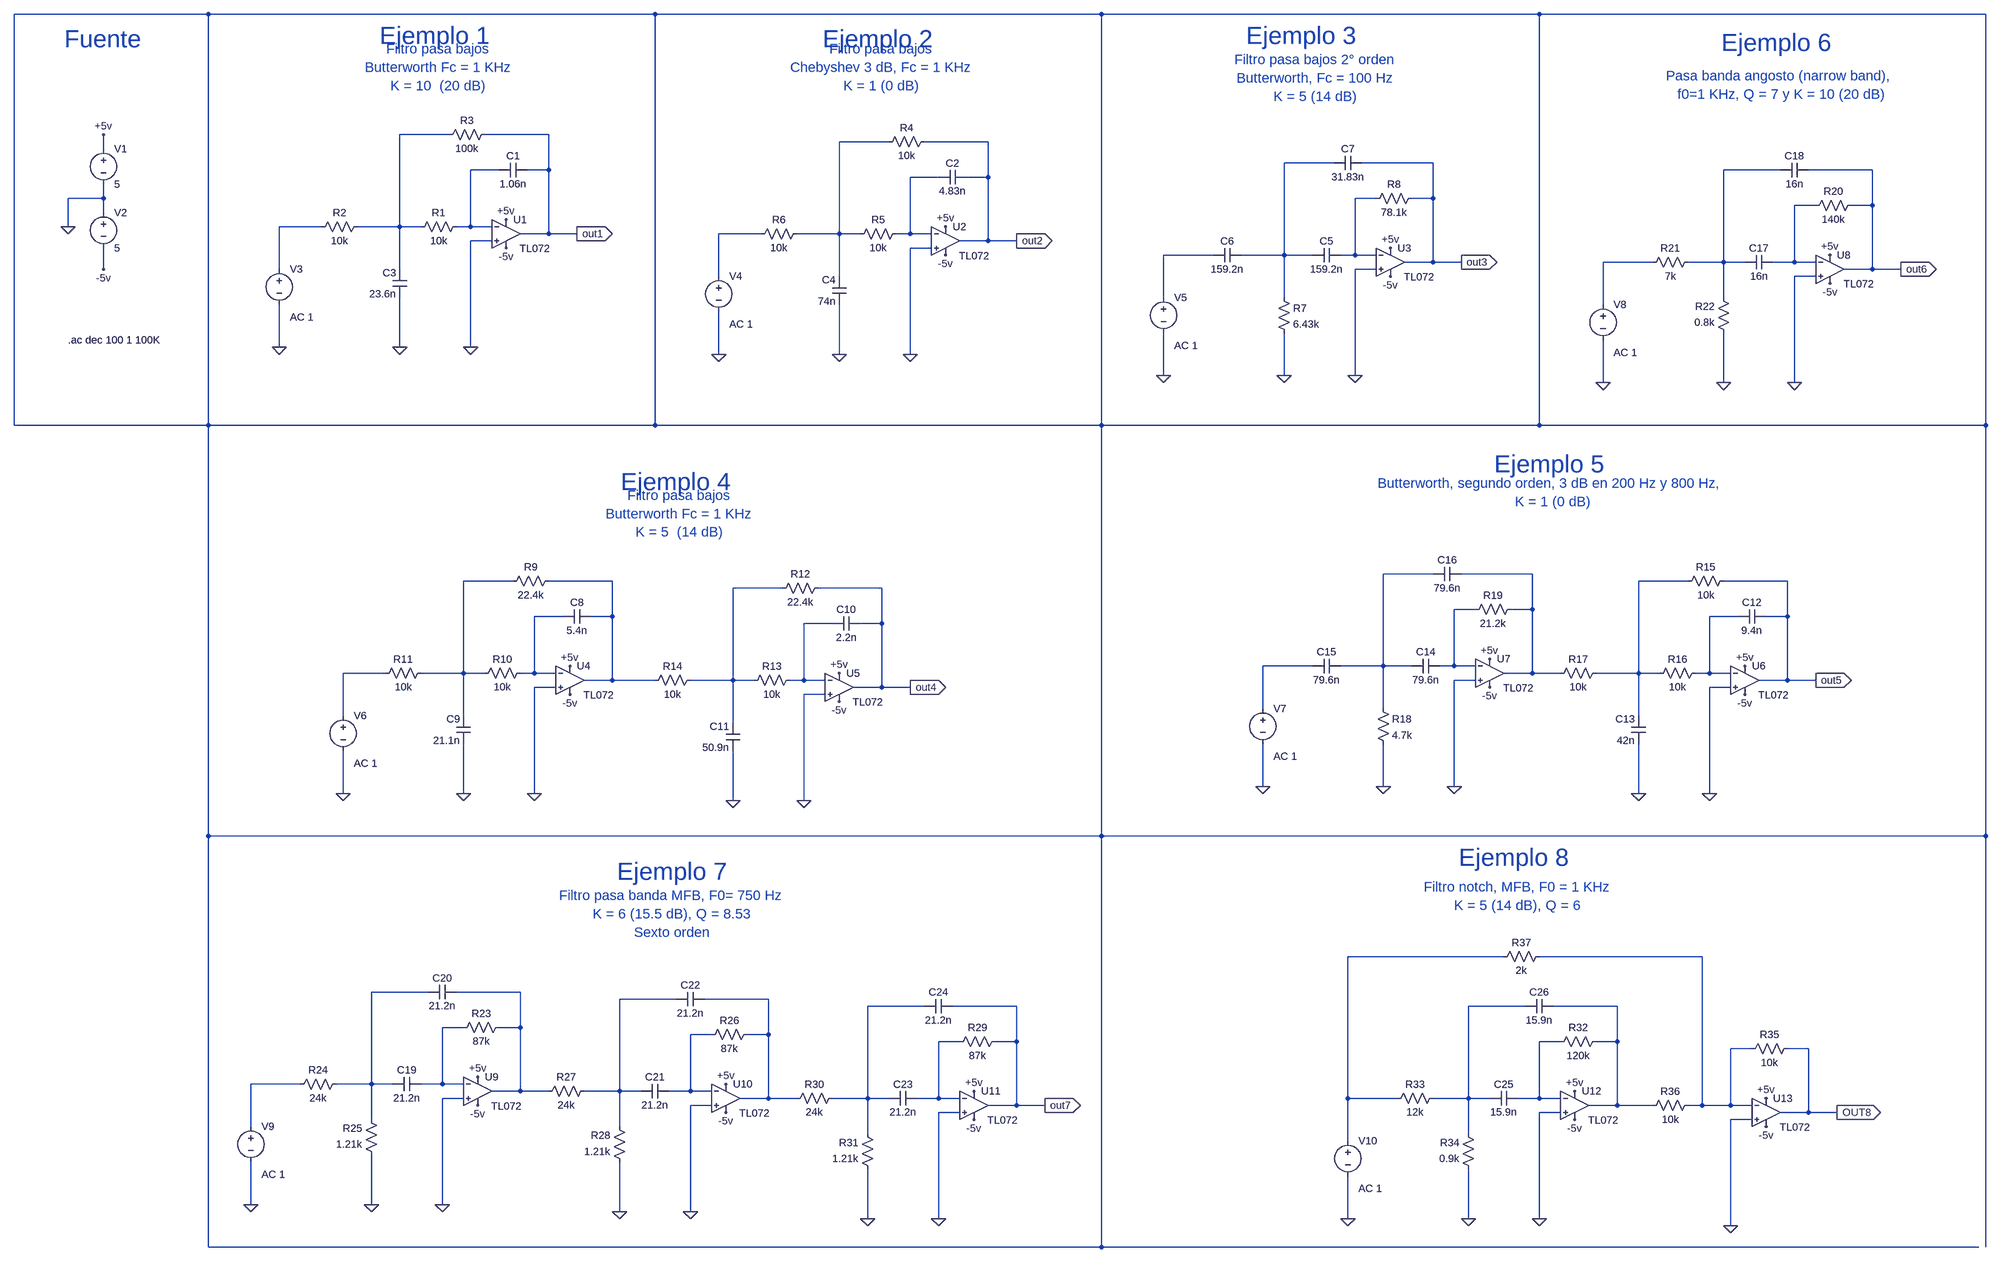
[diagram p0: schematic Filtros2.asc]
Filtros2.asc, the LTspice schematic file:
Version 4
SHEET 1 7476 4980
WIRE -352 -464 -832 -464
WIRE 656 -464 -352 -464
WIRE 1664 -464 656 -464
WIRE 2672 -464 1664 -464
WIRE 3680 -464 2672 -464
WIRE 192 -192 80 -192
WIRE 416 -192 272 -192
WIRE 1184 -176 1072 -176
WIRE 1408 -176 1264 -176
WIRE -592 -160 -592 -192
WIRE 2208 -128 2096 -128
WIRE 2432 -128 2272 -128
WIRE 304 -112 240 -112
WIRE 416 -112 416 -192
WIRE 416 -112 368 -112
WIRE 3216 -112 3088 -112
WIRE 3424 -112 3280 -112
WIRE 1296 -96 1232 -96
WIRE 1408 -96 1408 -176
WIRE 1408 -96 1360 -96
WIRE -592 -48 -592 -80
WIRE -592 -48 -672 -48
WIRE 2304 -48 2256 -48
WIRE 2432 -48 2432 -128
WIRE 2432 -48 2384 -48
WIRE 3296 -32 3248 -32
WIRE 3424 -32 3424 -112
WIRE 3424 -32 3376 -32
WIRE -592 -16 -592 -48
WIRE -672 16 -672 -48
WIRE -96 16 -192 16
WIRE 80 16 80 -192
WIRE 80 16 -16 16
WIRE 128 16 80 16
WIRE 240 16 240 -112
WIRE 240 16 208 16
WIRE 288 16 240 16
WIRE 416 32 416 -112
WIRE 416 32 352 32
WIRE 480 32 416 32
WIRE 896 32 800 32
WIRE 1072 32 1072 -176
WIRE 1072 32 976 32
WIRE 1120 32 1072 32
WIRE 1232 32 1232 -96
WIRE 1232 32 1200 32
WIRE 1280 32 1232 32
WIRE 288 48 240 48
WIRE 1408 48 1408 -96
WIRE 1408 48 1344 48
WIRE 1472 48 1408 48
WIRE 1280 64 1232 64
WIRE 1936 80 1824 80
WIRE 2096 80 2096 -128
WIRE 2096 80 2000 80
WIRE 2160 80 2096 80
WIRE 2256 80 2256 -48
WIRE 2256 80 2224 80
WIRE 2304 80 2256 80
WIRE 2432 96 2432 -48
WIRE 2432 96 2368 96
WIRE 2496 96 2432 96
WIRE 2928 96 2816 96
WIRE 3088 96 3088 -112
WIRE 3088 96 3008 96
WIRE 3136 96 3088 96
WIRE 3248 96 3248 -32
WIRE 3248 96 3200 96
WIRE 3296 96 3248 96
WIRE -592 112 -592 64
WIRE -192 112 -192 16
WIRE 80 112 80 16
WIRE 2304 112 2256 112
WIRE 3424 112 3424 -32
WIRE 3424 112 3360 112
WIRE 3488 112 3424 112
WIRE 800 128 800 32
WIRE 1072 128 1072 32
WIRE 3296 128 3248 128
WIRE 1824 176 1824 80
WIRE 2096 176 2096 80
WIRE 3088 176 3088 96
WIRE 2816 192 2816 96
WIRE -192 288 -192 192
WIRE 80 288 80 176
WIRE 240 288 240 48
WIRE 800 304 800 208
WIRE 1072 304 1072 192
WIRE 1232 304 1232 64
WIRE 1824 352 1824 256
WIRE 2096 352 2096 256
WIRE 2256 352 2256 112
WIRE 2816 368 2816 272
WIRE 3088 368 3088 256
WIRE 3248 368 3248 128
WIRE -832 464 -832 -464
WIRE -352 464 -352 -464
WIRE -352 464 -832 464
WIRE 656 464 656 -464
WIRE 656 464 -352 464
WIRE 1664 464 1664 -464
WIRE 1664 464 656 464
WIRE 2672 464 2672 -464
WIRE 2672 464 1664 464
WIRE 3680 464 3680 -464
WIRE 3680 464 2672 464
WIRE 2432 800 2320 800
WIRE 2656 800 2496 800
WIRE 336 816 224 816
WIRE 560 816 416 816
WIRE 3008 816 2896 816
WIRE 3232 816 3088 816
WIRE 944 832 832 832
WIRE 1168 832 1024 832
WIRE 2528 880 2480 880
WIRE 2656 880 2656 800
WIRE 2656 880 2608 880
WIRE 448 896 384 896
WIRE 560 896 560 816
WIRE 560 896 512 896
WIRE 3120 896 3056 896
WIRE 3232 896 3232 816
WIRE 3232 896 3184 896
WIRE 1056 912 992 912
WIRE 1168 912 1168 832
WIRE 1168 912 1120 912
WIRE 2160 1008 2048 1008
WIRE 2320 1008 2320 800
WIRE 2320 1008 2224 1008
WIRE 2384 1008 2320 1008
WIRE 2480 1008 2480 880
WIRE 2480 1008 2448 1008
WIRE 2528 1008 2480 1008
WIRE 48 1024 -48 1024
WIRE 224 1024 224 816
WIRE 224 1024 128 1024
WIRE 272 1024 224 1024
WIRE 384 1024 384 896
WIRE 384 1024 352 1024
WIRE 432 1024 384 1024
WIRE 2656 1024 2656 880
WIRE 2656 1024 2592 1024
WIRE 2720 1024 2656 1024
WIRE 2896 1024 2896 816
WIRE 2896 1024 2800 1024
WIRE 2944 1024 2896 1024
WIRE 3056 1024 3056 896
WIRE 3056 1024 3024 1024
WIRE 3104 1024 3056 1024
WIRE 560 1040 560 896
WIRE 560 1040 496 1040
WIRE 656 1040 560 1040
WIRE 832 1040 832 832
WIRE 832 1040 736 1040
WIRE 880 1040 832 1040
WIRE 992 1040 992 912
WIRE 992 1040 960 1040
WIRE 1040 1040 992 1040
WIRE 2528 1040 2480 1040
WIRE 3232 1040 3232 896
WIRE 3232 1040 3168 1040
WIRE 3296 1040 3232 1040
WIRE 432 1056 384 1056
WIRE 1168 1056 1168 912
WIRE 1168 1056 1104 1056
WIRE 1232 1056 1168 1056
WIRE 3104 1056 3056 1056
WIRE 1040 1072 992 1072
WIRE 2048 1104 2048 1008
WIRE 2320 1104 2320 1008
WIRE -48 1120 -48 1024
WIRE 224 1120 224 1024
WIRE 2896 1120 2896 1024
WIRE 832 1136 832 1040
WIRE 2048 1280 2048 1184
WIRE 2320 1280 2320 1184
WIRE 2480 1280 2480 1040
WIRE -48 1296 -48 1200
WIRE 224 1296 224 1184
WIRE 384 1296 384 1056
WIRE 2896 1296 2896 1184
WIRE 3056 1296 3056 1056
WIRE 832 1312 832 1200
WIRE 992 1312 992 1072
WIRE -352 1392 -352 464
WIRE 1664 1392 1664 464
WIRE 1664 1392 -352 1392
WIRE 3680 1392 3680 464
WIRE 3680 1392 1664 1392
WIRE 2592 1664 2240 1664
WIRE 3040 1664 2672 1664
WIRE 144 1744 16 1744
WIRE 352 1744 208 1744
WIRE 704 1760 576 1760
WIRE 912 1760 768 1760
WIRE 1264 1776 1136 1776
WIRE 1472 1776 1328 1776
WIRE 2640 1776 2512 1776
WIRE 2848 1776 2704 1776
WIRE 224 1824 176 1824
WIRE 352 1824 352 1744
WIRE 352 1824 304 1824
WIRE 784 1840 736 1840
WIRE 912 1840 912 1760
WIRE 912 1840 864 1840
WIRE 1344 1856 1296 1856
WIRE 1472 1856 1472 1776
WIRE 1472 1856 1424 1856
WIRE 2720 1856 2672 1856
WIRE 2848 1856 2848 1776
WIRE 2848 1856 2800 1856
WIRE 3152 1872 3104 1872
WIRE 3280 1872 3232 1872
WIRE -144 1952 -256 1952
WIRE 16 1952 16 1744
WIRE 16 1952 -64 1952
WIRE 64 1952 16 1952
WIRE 176 1952 176 1824
WIRE 176 1952 128 1952
WIRE 224 1952 176 1952
WIRE 352 1968 352 1824
WIRE 352 1968 288 1968
WIRE 416 1968 352 1968
WIRE 576 1968 576 1760
WIRE 576 1968 496 1968
WIRE 624 1968 576 1968
WIRE 736 1968 736 1840
WIRE 736 1968 688 1968
WIRE 784 1968 736 1968
WIRE 224 1984 176 1984
WIRE 912 1984 912 1840
WIRE 912 1984 848 1984
WIRE 976 1984 912 1984
WIRE 1136 1984 1136 1776
WIRE 1136 1984 1056 1984
WIRE 1184 1984 1136 1984
WIRE 1296 1984 1296 1856
WIRE 1296 1984 1248 1984
WIRE 1344 1984 1296 1984
WIRE 2240 1984 2240 1664
WIRE 2352 1984 2240 1984
WIRE 2512 1984 2512 1776
WIRE 2512 1984 2432 1984
WIRE 2560 1984 2512 1984
WIRE 2672 1984 2672 1856
WIRE 2672 1984 2624 1984
WIRE 2720 1984 2672 1984
WIRE 784 2000 736 2000
WIRE 1472 2000 1472 1856
WIRE 1472 2000 1408 2000
WIRE 1536 2000 1472 2000
WIRE 2848 2000 2848 1856
WIRE 2848 2000 2784 2000
WIRE 2928 2000 2848 2000
WIRE 3040 2000 3040 1664
WIRE 3040 2000 3008 2000
WIRE 3104 2000 3104 1872
WIRE 3104 2000 3040 2000
WIRE 3152 2000 3104 2000
WIRE 1344 2016 1296 2016
WIRE 2720 2016 2672 2016
WIRE 3280 2016 3280 1872
WIRE 3280 2016 3216 2016
WIRE 3344 2016 3280 2016
WIRE 16 2032 16 1952
WIRE 3152 2032 3104 2032
WIRE -256 2048 -256 1952
WIRE 576 2048 576 1968
WIRE 1136 2064 1136 1984
WIRE 2512 2064 2512 1984
WIRE 2240 2080 2240 1984
WIRE -256 2224 -256 2128
WIRE 16 2224 16 2112
WIRE 176 2224 176 1984
WIRE 576 2240 576 2128
WIRE 736 2240 736 2000
WIRE 1136 2256 1136 2144
WIRE 1296 2256 1296 2016
WIRE 2240 2256 2240 2160
WIRE 2512 2256 2512 2144
WIRE 2672 2256 2672 2016
WIRE 3104 2272 3104 2032
WIRE -352 2320 -352 1392
WIRE 1664 2320 1664 1392
WIRE 1664 2320 -352 2320
WIRE 3664 2320 1664 2320
WIRE 3680 2320 3680 1392
FLAG -672 16 0
FLAG -592 -192 +5v
FLAG -592 112 -5v
FLAG 320 64 -5v
FLAG 320 0 +5v
FLAG 480 32 out1
IOPIN 480 32 Out
FLAG 240 288 0
FLAG 80 288 0
FLAG -192 288 0
FLAG 1312 80 -5v
FLAG 1312 16 +5v
FLAG 1472 48 out2
IOPIN 1472 48 Out
FLAG 1232 304 0
FLAG 1072 304 0
FLAG 800 304 0
FLAG 2336 128 -5v
FLAG 2336 64 +5v
FLAG 2496 96 out3
IOPIN 2496 96 Out
FLAG 2256 352 0
FLAG 2096 352 0
FLAG 1824 352 0
FLAG 464 1072 -5v
FLAG 464 1008 +5v
FLAG 384 1296 0
FLAG 224 1296 0
FLAG -48 1296 0
FLAG 1072 1088 -5v
FLAG 1072 1024 +5v
FLAG 992 1312 0
FLAG 832 1312 0
FLAG 1232 1056 out4
IOPIN 1232 1056 Out
FLAG 3136 1072 -5v
FLAG 3136 1008 +5v
FLAG 3056 1296 0
FLAG 2896 1296 0
FLAG 3296 1040 out5
IOPIN 3296 1040 Out
FLAG 2560 1056 -5v
FLAG 2560 992 +5v
FLAG 2480 1280 0
FLAG 2320 1280 0
FLAG 2048 1280 0
FLAG 3328 144 -5v
FLAG 3328 80 +5v
FLAG 3248 368 0
FLAG 3088 368 0
FLAG 3488 112 out6
IOPIN 3488 112 Out
FLAG 2816 368 0
FLAG 256 2000 -5v
FLAG 256 1936 +5v
FLAG 176 2224 0
FLAG 16 2224 0
FLAG -256 2224 0
FLAG 816 2016 -5v
FLAG 816 1952 +5v
FLAG 736 2240 0
FLAG 576 2240 0
FLAG 1376 2032 -5v
FLAG 1376 1968 +5v
FLAG 1296 2256 0
FLAG 1136 2256 0
FLAG 1536 2000 out7
IOPIN 1536 2000 Out
FLAG 2752 2032 -5v
FLAG 2752 1968 +5v
FLAG 2672 2256 0
FLAG 2512 2256 0
FLAG 2240 2256 0
FLAG 3184 2048 -5v
FLAG 3184 1984 +5v
FLAG 3104 2272 0
FLAG 3344 2016 OUT8
IOPIN 3344 2016 Out
SYMBOL AutoGenerated\\TL072 320 32 R0
WINDOW 3 65 18 Top 2
SYMATTR InstName U1
SYMBOL voltage -592 -176 R0
WINDOW 123 0 0 Left 0
WINDOW 39 0 0 Left 0
SYMATTR InstName V1
SYMATTR Value 5
SYMBOL voltage -592 -32 R0
WINDOW 123 0 0 Left 0
WINDOW 39 0 0 Left 0
SYMATTR InstName V2
SYMATTR Value 5
SYMBOL res 176 -176 R270
WINDOW 0 32 56 VTop 2
WINDOW 3 0 56 VBottom 2
SYMATTR InstName R3
SYMATTR Value 100k
SYMBOL voltage -192 96 R0
WINDOW 123 24 124 Left 2
WINDOW 39 0 0 Left 0
SYMATTR Value2 AC 1
SYMATTR InstName V3
SYMATTR Value ""
SYMBOL cap 368 -128 R90
WINDOW 0 0 32 VBottom 2
WINDOW 3 32 32 VTop 2
SYMATTR InstName C1
SYMATTR Value 1.06n
SYMBOL cap 96 176 R180
WINDOW 0 24 56 Left 2
WINDOW 3 24 8 Left 2
SYMATTR InstName C3
SYMATTR Value 23.6n
SYMBOL res 112 32 R270
WINDOW 0 32 56 VTop 2
WINDOW 3 0 56 VBottom 2
SYMATTR InstName R1
SYMATTR Value 10k
SYMBOL res -112 32 R270
WINDOW 0 32 56 VTop 2
WINDOW 3 0 56 VBottom 2
SYMATTR InstName R2
SYMATTR Value 10k
SYMBOL AutoGenerated\\TL072 1312 48 R0
WINDOW 3 65 18 Top 2
SYMATTR InstName U2
SYMBOL res 1168 -160 R270
WINDOW 0 32 56 VTop 2
WINDOW 3 0 56 VBottom 2
SYMATTR InstName R4
SYMATTR Value 10k
SYMBOL voltage 800 112 R0
WINDOW 123 24 124 Left 2
WINDOW 39 0 0 Left 0
SYMATTR Value2 AC 1
SYMATTR InstName V4
SYMATTR Value ""
SYMBOL cap 1360 -112 R90
WINDOW 0 0 32 VBottom 2
WINDOW 3 32 32 VTop 2
SYMATTR InstName C2
SYMATTR Value 4.83n
SYMBOL cap 1088 192 R180
WINDOW 0 24 56 Left 2
WINDOW 3 24 8 Left 2
SYMATTR InstName C4
SYMATTR Value 74n
SYMBOL res 1104 48 R270
WINDOW 0 32 56 VTop 2
WINDOW 3 0 56 VBottom 2
SYMATTR InstName R5
SYMATTR Value 10k
SYMBOL res 880 48 R270
WINDOW 0 32 56 VTop 2
WINDOW 3 0 56 VBottom 2
SYMATTR InstName R6
SYMATTR Value 10k
SYMBOL AutoGenerated\\TL072 2336 96 R0
WINDOW 3 65 18 Top 2
SYMATTR InstName U3
SYMBOL voltage 1824 160 R0
WINDOW 123 24 124 Left 2
WINDOW 39 0 0 Left 0
SYMATTR Value2 AC 1
SYMATTR InstName V5
SYMATTR Value ""
SYMBOL cap 2224 64 R90
WINDOW 0 0 32 VBottom 2
WINDOW 3 32 32 VTop 2
SYMATTR InstName C5
SYMATTR Value 159.2n
SYMBOL cap 2000 64 R90
WINDOW 0 0 32 VBottom 2
WINDOW 3 32 32 VTop 2
SYMATTR InstName C6
SYMATTR Value 159.2n
SYMBOL cap 2272 -144 R90
WINDOW 0 0 32 VBottom 2
WINDOW 3 32 32 VTop 2
SYMATTR InstName C7
SYMATTR Value 31.83n
SYMBOL res 2080 160 R0
SYMATTR InstName R7
SYMATTR Value 6.43k
SYMBOL res 2400 -64 R90
WINDOW 0 0 56 VBottom 2
WINDOW 3 32 56 VTop 2
SYMATTR InstName R8
SYMATTR Value 78.1k
SYMBOL AutoGenerated\\TL072 464 1040 R0
WINDOW 3 65 18 Top 2
SYMATTR InstName U4
SYMBOL res 320 832 R270
WINDOW 0 32 56 VTop 2
WINDOW 3 0 56 VBottom 2
SYMATTR InstName R9
SYMATTR Value 22.4k
SYMBOL voltage -48 1104 R0
WINDOW 123 24 124 Left 2
WINDOW 39 0 0 Left 0
SYMATTR Value2 AC 1
SYMATTR InstName V6
SYMATTR Value ""
SYMBOL cap 512 880 R90
WINDOW 0 0 32 VBottom 2
WINDOW 3 32 32 VTop 2
SYMATTR InstName C8
SYMATTR Value 5.4n
SYMBOL cap 240 1184 R180
WINDOW 0 24 56 Left 2
WINDOW 3 24 8 Left 2
SYMATTR InstName C9
SYMATTR Value 21.1n
SYMBOL res 256 1040 R270
WINDOW 0 32 56 VTop 2
WINDOW 3 0 56 VBottom 2
SYMATTR InstName R10
SYMATTR Value 10k
SYMBOL res 32 1040 R270
WINDOW 0 32 56 VTop 2
WINDOW 3 0 56 VBottom 2
SYMATTR InstName R11
SYMATTR Value 10k
SYMBOL AutoGenerated\\TL072 1072 1056 R0
WINDOW 3 65 18 Top 2
SYMATTR InstName U5
SYMBOL res 928 848 R270
WINDOW 0 32 56 VTop 2
WINDOW 3 0 56 VBottom 2
SYMATTR InstName R12
SYMATTR Value 22.4k
SYMBOL cap 1120 896 R90
WINDOW 0 0 32 VBottom 2
WINDOW 3 32 32 VTop 2
SYMATTR InstName C10
SYMATTR Value 2.2n
SYMBOL cap 848 1200 R180
WINDOW 0 24 56 Left 2
WINDOW 3 24 8 Left 2
SYMATTR InstName C11
SYMATTR Value 50.9n
SYMBOL res 864 1056 R270
WINDOW 0 32 56 VTop 2
WINDOW 3 0 56 VBottom 2
SYMATTR InstName R13
SYMATTR Value 10k
SYMBOL res 640 1056 R270
WINDOW 0 32 56 VTop 2
WINDOW 3 0 56 VBottom 2
SYMATTR InstName R14
SYMATTR Value 10k
SYMBOL AutoGenerated\\TL072 3136 1040 R0
WINDOW 3 65 18 Top 2
SYMATTR InstName U6
SYMBOL res 2992 832 R270
WINDOW 0 32 56 VTop 2
WINDOW 3 0 56 VBottom 2
SYMATTR InstName R15
SYMATTR Value 10k
SYMBOL cap 3184 880 R90
WINDOW 0 0 32 VBottom 2
WINDOW 3 32 32 VTop 2
SYMATTR InstName C12
SYMATTR Value 9.4n
SYMBOL cap 2912 1184 R180
WINDOW 0 24 56 Left 2
WINDOW 3 24 8 Left 2
SYMATTR InstName C13
SYMATTR Value 42n
SYMBOL res 2928 1040 R270
WINDOW 0 32 56 VTop 2
WINDOW 3 0 56 VBottom 2
SYMATTR InstName R16
SYMATTR Value 10k
SYMBOL res 2704 1040 R270
WINDOW 0 32 56 VTop 2
WINDOW 3 0 56 VBottom 2
SYMATTR InstName R17
SYMATTR Value 10k
SYMBOL AutoGenerated\\TL072 2560 1024 R0
WINDOW 3 65 18 Top 2
SYMATTR InstName U7
SYMBOL voltage 2048 1088 R0
WINDOW 123 24 124 Left 2
WINDOW 39 0 0 Left 0
SYMATTR Value2 AC 1
SYMATTR InstName V7
SYMATTR Value ""
SYMBOL cap 2448 992 R90
WINDOW 0 0 32 VBottom 2
WINDOW 3 32 32 VTop 2
SYMATTR InstName C14
SYMATTR Value 79.6n
SYMBOL cap 2224 992 R90
WINDOW 0 0 32 VBottom 2
WINDOW 3 32 32 VTop 2
SYMATTR InstName C15
SYMATTR Value 79.6n
SYMBOL cap 2496 784 R90
WINDOW 0 0 32 VBottom 2
WINDOW 3 32 32 VTop 2
SYMATTR InstName C16
SYMATTR Value 79.6n
SYMBOL res 2304 1088 R0
SYMATTR InstName R18
SYMATTR Value 4.7k
SYMBOL res 2624 864 R90
WINDOW 0 0 56 VBottom 2
WINDOW 3 32 56 VTop 2
SYMATTR InstName R19
SYMATTR Value 21.2k
SYMBOL AutoGenerated\\TL072 3328 112 R0
WINDOW 3 65 18 Top 2
SYMATTR InstName U8
SYMBOL res 3392 -48 R90
WINDOW 0 0 56 VBottom 2
WINDOW 3 32 56 VTop 2
SYMATTR InstName R20
SYMATTR Value 140k
SYMBOL res 3024 80 R90
WINDOW 0 0 56 VBottom 2
WINDOW 3 32 56 VTop 2
SYMATTR InstName R21
SYMATTR Value 7k
SYMBOL res 3104 272 R180
WINDOW 0 36 76 Left 2
WINDOW 3 36 40 Left 2
SYMATTR InstName R22
SYMATTR Value 0.8k
SYMBOL cap 3200 80 R90
WINDOW 0 0 32 VBottom 2
WINDOW 3 32 32 VTop 2
SYMATTR InstName C17
SYMATTR Value 16n
SYMBOL cap 3280 -128 R90
WINDOW 0 0 32 VBottom 2
WINDOW 3 32 32 VTop 2
SYMATTR InstName C18
SYMATTR Value 16n
SYMBOL voltage 2816 176 R0
WINDOW 123 24 124 Left 2
WINDOW 39 0 0 Left 0
SYMATTR Value2 AC 1
SYMATTR InstName V8
SYMATTR Value ""
SYMBOL AutoGenerated\\TL072 256 1968 R0
WINDOW 3 65 18 Top 2
SYMATTR InstName U9
SYMBOL res 320 1808 R90
WINDOW 0 0 56 VBottom 2
WINDOW 3 32 56 VTop 2
SYMATTR InstName R23
SYMATTR Value 87k
SYMBOL res -48 1936 R90
WINDOW 0 0 56 VBottom 2
WINDOW 3 32 56 VTop 2
SYMATTR InstName R24
SYMATTR Value 24k
SYMBOL res 32 2128 R180
WINDOW 0 36 76 Left 2
WINDOW 3 36 40 Left 2
SYMATTR InstName R25
SYMATTR Value 1.21k
SYMBOL cap 128 1936 R90
WINDOW 0 0 32 VBottom 2
WINDOW 3 32 32 VTop 2
SYMATTR InstName C19
SYMATTR Value 21.2n
SYMBOL cap 208 1728 R90
WINDOW 0 0 32 VBottom 2
WINDOW 3 32 32 VTop 2
SYMATTR InstName C20
SYMATTR Value 21.2n
SYMBOL voltage -256 2032 R0
WINDOW 123 24 124 Left 2
WINDOW 39 0 0 Left 0
SYMATTR Value2 AC 1
SYMATTR InstName V9
SYMATTR Value ""
SYMBOL AutoGenerated\\TL072 816 1984 R0
WINDOW 3 65 18 Top 2
SYMATTR InstName U10
SYMBOL res 880 1824 R90
WINDOW 0 0 56 VBottom 2
WINDOW 3 32 56 VTop 2
SYMATTR InstName R26
SYMATTR Value 87k
SYMBOL res 512 1952 R90
WINDOW 0 0 56 VBottom 2
WINDOW 3 32 56 VTop 2
SYMATTR InstName R27
SYMATTR Value 24k
SYMBOL res 592 2144 R180
WINDOW 0 36 76 Left 2
WINDOW 3 36 40 Left 2
SYMATTR InstName R28
SYMATTR Value 1.21k
SYMBOL cap 688 1952 R90
WINDOW 0 0 32 VBottom 2
WINDOW 3 32 32 VTop 2
SYMATTR InstName C21
SYMATTR Value 21.2n
SYMBOL cap 768 1744 R90
WINDOW 0 0 32 VBottom 2
WINDOW 3 32 32 VTop 2
SYMATTR InstName C22
SYMATTR Value 21.2n
SYMBOL AutoGenerated\\TL072 1376 2000 R0
WINDOW 3 65 18 Top 2
SYMATTR InstName U11
SYMBOL res 1440 1840 R90
WINDOW 0 0 56 VBottom 2
WINDOW 3 32 56 VTop 2
SYMATTR InstName R29
SYMATTR Value 87k
SYMBOL res 1072 1968 R90
WINDOW 0 0 56 VBottom 2
WINDOW 3 32 56 VTop 2
SYMATTR InstName R30
SYMATTR Value 24k
SYMBOL res 1152 2160 R180
WINDOW 0 36 76 Left 2
WINDOW 3 36 40 Left 2
SYMATTR InstName R31
SYMATTR Value 1.21k
SYMBOL cap 1248 1968 R90
WINDOW 0 0 32 VBottom 2
WINDOW 3 32 32 VTop 2
SYMATTR InstName C23
SYMATTR Value 21.2n
SYMBOL cap 1328 1760 R90
WINDOW 0 0 32 VBottom 2
WINDOW 3 32 32 VTop 2
SYMATTR InstName C24
SYMATTR Value 21.2n
SYMBOL AutoGenerated\\TL072 2752 2000 R0
WINDOW 3 65 18 Top 2
SYMATTR InstName U12
SYMBOL res 2816 1840 R90
WINDOW 0 0 56 VBottom 2
WINDOW 3 32 56 VTop 2
SYMATTR InstName R32
SYMATTR Value 120k
SYMBOL res 2448 1968 R90
WINDOW 0 0 56 VBottom 2
WINDOW 3 32 56 VTop 2
SYMATTR InstName R33
SYMATTR Value 12k
SYMBOL res 2528 2160 R180
WINDOW 0 36 76 Left 2
WINDOW 3 36 40 Left 2
SYMATTR InstName R34
SYMATTR Value 0.9k
SYMBOL cap 2624 1968 R90
WINDOW 0 0 32 VBottom 2
WINDOW 3 32 32 VTop 2
SYMATTR InstName C25
SYMATTR Value 15.9n
SYMBOL cap 2704 1760 R90
WINDOW 0 0 32 VBottom 2
WINDOW 3 32 32 VTop 2
SYMATTR InstName C26
SYMATTR Value 15.9n
SYMBOL voltage 2240 2064 R0
WINDOW 123 24 124 Left 2
WINDOW 39 0 0 Left 0
SYMATTR Value2 AC 1
SYMATTR InstName V10
SYMATTR Value ""
SYMBOL AutoGenerated\\TL072 3184 2016 R0
WINDOW 3 65 18 Top 2
SYMATTR InstName U13
SYMBOL res 3248 1856 R90
WINDOW 0 0 56 VBottom 2
WINDOW 3 32 56 VTop 2
SYMATTR InstName R35
SYMATTR Value 10k
SYMBOL res 3024 1984 R90
WINDOW 0 0 56 VBottom 2
WINDOW 3 32 56 VTop 2
SYMATTR InstName R36
SYMATTR Value 10k
SYMBOL res 2688 1648 R90
WINDOW 0 0 56 VBottom 2
WINDOW 3 32 56 VTop 2
SYMATTR InstName R37
SYMATTR Value 2k
TEXT 168 -344 Center 3 ;Filtro pasa bajos\nButterworth Fc = 1 KHz\nK = 10  (20 dB)
TEXT 1168 -344 Center 3 ;Filtro pasa bajos\nChebyshev 3 dB, Fc = 1 KHz\nK = 1 (0 dB)
TEXT 2168 -320 Center 3 ;Filtro pasa bajos 2° orden\nButterworth, Fc = 100 Hz\nK = 5 (14 dB)
TEXT 160 -416 Center 5 ;Ejemplo 1
TEXT 1160 -408 Center 5 ;Ejemplo 2
TEXT 2136 -416 Center 5 ;Ejemplo 3
TEXT -592 -408 Center 5 ;Fuente
TEXT -672 272 Left 2 !.ac dec 100 1 100K
TEXT 712 664 Center 3 ;Filtro pasa bajos\nButterworth Fc = 1 KHz\nK = 5  (14 dB)
TEXT 704 592 Center 5 ;Ejemplo 4
TEXT 2696 552 Center 5 ;Ejemplo 5
TEXT 2704 616 Center 3 ;Butterworth, segundo orden, 3 dB en 200 Hz y 800 Hz, \nK = 1 (0 dB)
TEXT 3208 -400 Center 5 ;Ejemplo 6
TEXT 3216 -304 Center 3 ;Pasa banda angosto (narrow band),\n f0=1 KHz, Q = 7 y K = 10 (20 dB)
TEXT 696 1472 Center 5 ;Ejemplo 7
TEXT 696 1568 Center 3 ;Filtro pasa banda MFB, F0= 750 Hz\nK = 6 (15.5 dB), Q = 8.53\nSexto orden
TEXT 2616 1440 Center 5 ;Ejemplo 8
TEXT 2624 1528 Center 3 ;Filtro notch, MFB, F0 = 1 KHz\nK = 5 (14 dB), Q = 6

The netlist it stands for:
* Filtros2.asc
* U1: TL072 (symbol AutoGenerated\TL072 not available, pins judged from their places): In+=0 In-=N005 V+=+5v V-=-5v OUT=out1
V1 +5v 0 5
V2 0 -5v 5
R3 N002 out1 100k
V3 N010 0 AC 1
C1 out1 N005 1.06n
C3 0 N002 23.6n
R1 N002 N005 10k
R2 N010 N002 10k
* U2: TL072 (symbol AutoGenerated\TL072 not available, pins judged from their places): In+=0 In-=N007 V+=+5v V-=-5v OUT=out2
R4 N003 out2 10k
V4 N011 0 AC 1
C2 out2 N007 4.83n
C4 0 N003 74n
R5 N003 N007 10k
R6 N011 N003 10k
* U3: TL072 (symbol AutoGenerated\TL072 not available, pins judged from their places): In+=0 In-=N008 V+=+5v V-=-5v OUT=out3
V5 N012 0 AC 1
C5 N008 N004 159.2n
C6 N004 N012 159.2n
C7 out3 N004 31.83n
R7 N004 0 6.43k
R8 out3 N008 78.1k
* U4: TL072 (symbol AutoGenerated\TL072 not available, pins judged from their places): In+=0 In-=N021 V+=+5v V-=-5v OUT=N017
R9 N016 N017 22.4k
V6 N025 0 AC 1
C8 N017 N021 5.4n
C9 0 N016 21.1n
R10 N016 N021 10k
R11 N025 N016 10k
* U5: TL072 (symbol AutoGenerated\TL072 not available, pins judged from their places): In+=0 In-=N023 V+=+5v V-=-5v OUT=out4
R12 N019 out4 22.4k
C10 out4 N023 2.2n
C11 0 N019 50.9n
R13 N019 N023 10k
R14 N017 N019 10k
* U6: TL072 (symbol AutoGenerated\TL072 not available, pins judged from their places): In+=0 In-=N022 V+=+5v V-=-5v OUT=out5
R15 N018 out5 10k
C12 out5 N022 9.4n
C13 0 N018 42n
R16 N018 N022 10k
R17 N015 N018 10k
* U7: TL072 (symbol AutoGenerated\TL072 not available, pins judged from their places): In+=0 In-=N020 V+=+5v V-=-5v OUT=N015
V7 N024 0 AC 1
C14 N020 N014 79.6n
C15 N014 N024 79.6n
C16 N015 N014 79.6n
R18 N014 0 4.7k
R19 N015 N020 21.2k
* U8: TL072 (symbol AutoGenerated\TL072 not available, pins judged from their places): In+=0 In-=N009 V+=+5v V-=-5v OUT=out6
R20 out6 N009 140k
R21 N006 N013 7k
R22 0 N006 0.8k
C17 N009 N006 16n
C18 out6 N006 16n
V8 N013 0 AC 1
* U9: TL072 (symbol AutoGenerated\TL072 not available, pins judged from their places): In+=0 In-=N035 V+=+5v V-=-5v OUT=N029
R23 N029 N035 87k
R24 N028 N039 24k
R25 0 N028 1.21k
C19 N035 N028 21.2n
C20 N029 N028 21.2n
V9 N039 0 AC 1
* U10: TL072 (symbol AutoGenerated\TL072 not available, pins judged from their places): In+=0 In-=N036 V+=+5v V-=-5v OUT=N031
R26 N031 N036 87k
R27 N030 N029 24k
R28 0 N030 1.21k
C21 N036 N030 21.2n
C22 N031 N030 21.2n
* U11: TL072 (symbol AutoGenerated\TL072 not available, pins judged from their places): In+=0 In-=N037 V+=+5v V-=-5v OUT=out7
R29 out7 N037 87k
R30 N032 N031 24k
R31 0 N032 1.21k
C23 N037 N032 21.2n
C24 out7 N032 21.2n
* U12: TL072 (symbol AutoGenerated\TL072 not available, pins judged from their places): In+=0 In-=N038 V+=+5v V-=-5v OUT=N034
R32 N034 N038 120k
R33 N033 N026 12k
R34 0 N033 0.9k
C25 N038 N033 15.9n
C26 N034 N033 15.9n
V10 N026 0 AC 1
* U13: TL072 (symbol AutoGenerated\TL072 not available, pins judged from their places): In+=0 In-=N027 V+=+5v V-=-5v OUT=OUT8
R35 OUT8 N027 10k
R36 N027 N034 10k
R37 N027 N026 2k
* Filtro pasa bajos
* Butterworth Fc = 1 KHz
* K = 10  (20 dB)
* Filtro pasa bajos
* Chebyshev 3 dB, Fc = 1 KHz
* K = 1 (0 dB)
* Filtro pasa bajos 2° orden
* Butterworth, Fc = 100 Hz
* K = 5 (14 dB)
* Ejemplo 1
* Ejemplo 2
* Ejemplo 3
* Fuente
.ac dec 100 1 100K
* Filtro pasa bajos
* Butterworth Fc = 1 KHz
* K = 5  (14 dB)
* Ejemplo 4
* Ejemplo 5
* Butterworth, segundo orden, 3 dB en 200 Hz y 800 Hz,
* K = 1 (0 dB)
* Ejemplo 6
* Pasa banda angosto (narrow band),
*  f0=1 KHz, Q = 7 y K = 10 (20 dB)
* Ejemplo 7
* Filtro pasa banda MFB, F0= 750 Hz
* K = 6 (15.5 dB), Q = 8.53
* Sexto orden
* Ejemplo 8
* Filtro notch, MFB, F0 = 1 KHz
* K = 5 (14 dB), Q = 6
.backanno
.end